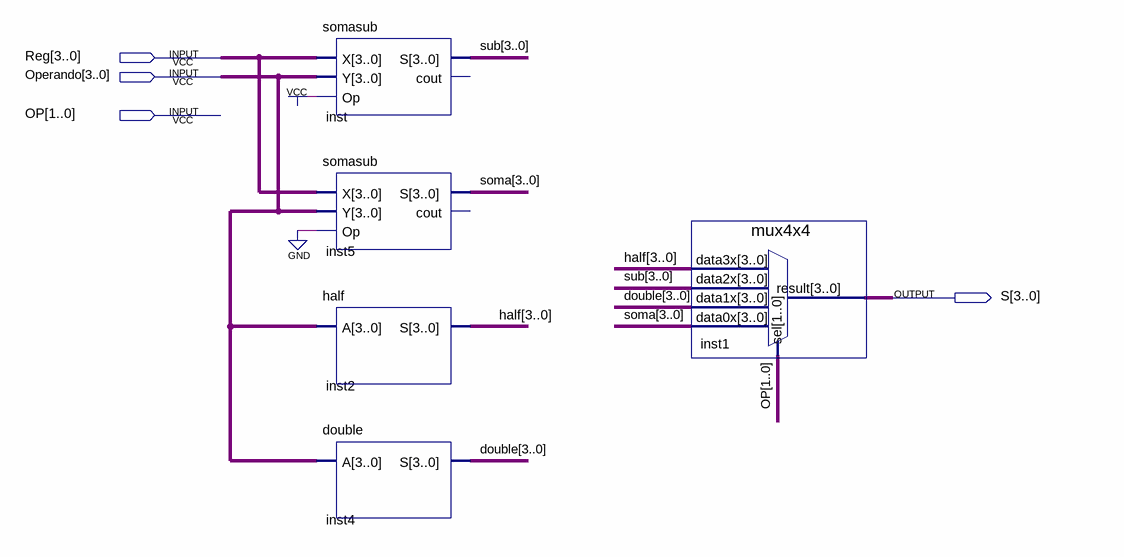
[diagram p0: schematic sheet]
// Quartus schematic ula.bdf as structural Verilog: 5 symbols, 4 pins
module ula (
  input  [3:0] Reg,
  input  [3:0] Operando,
  input  [1:0] OP,
  output [3:0] S
);

  wire [3:0] double, half, soma, sub;

  somasub inst (.X(Reg), .Y(Operando), .Op(1'b1), .S(sub));  // open: cout
  somasub inst5 (.X(Reg), .Y(Operando), .Op(1'b0), .S(soma));  // open: cout
  half inst2 (.A(Operando), .S(half));
  double inst4 (.A(Operando), .S(double));
  mux4x4 inst1 (.data3x(half), .data2x(sub), .data1x(double), .data0x(soma), .sel(OP), .result(S));
endmodule
